# Altium schematic sheet [09] - PCB AND MECHANICALS.SchDoc
size A2; Organization: Altium Limited; Address1: L3, 12a Rodborough Rd; Address2: Frenchs Forest; Address3: NSW; Address4: Australia 2086; DocumentNumber: 9; SheetNumber: 9; SheetTotal: 11
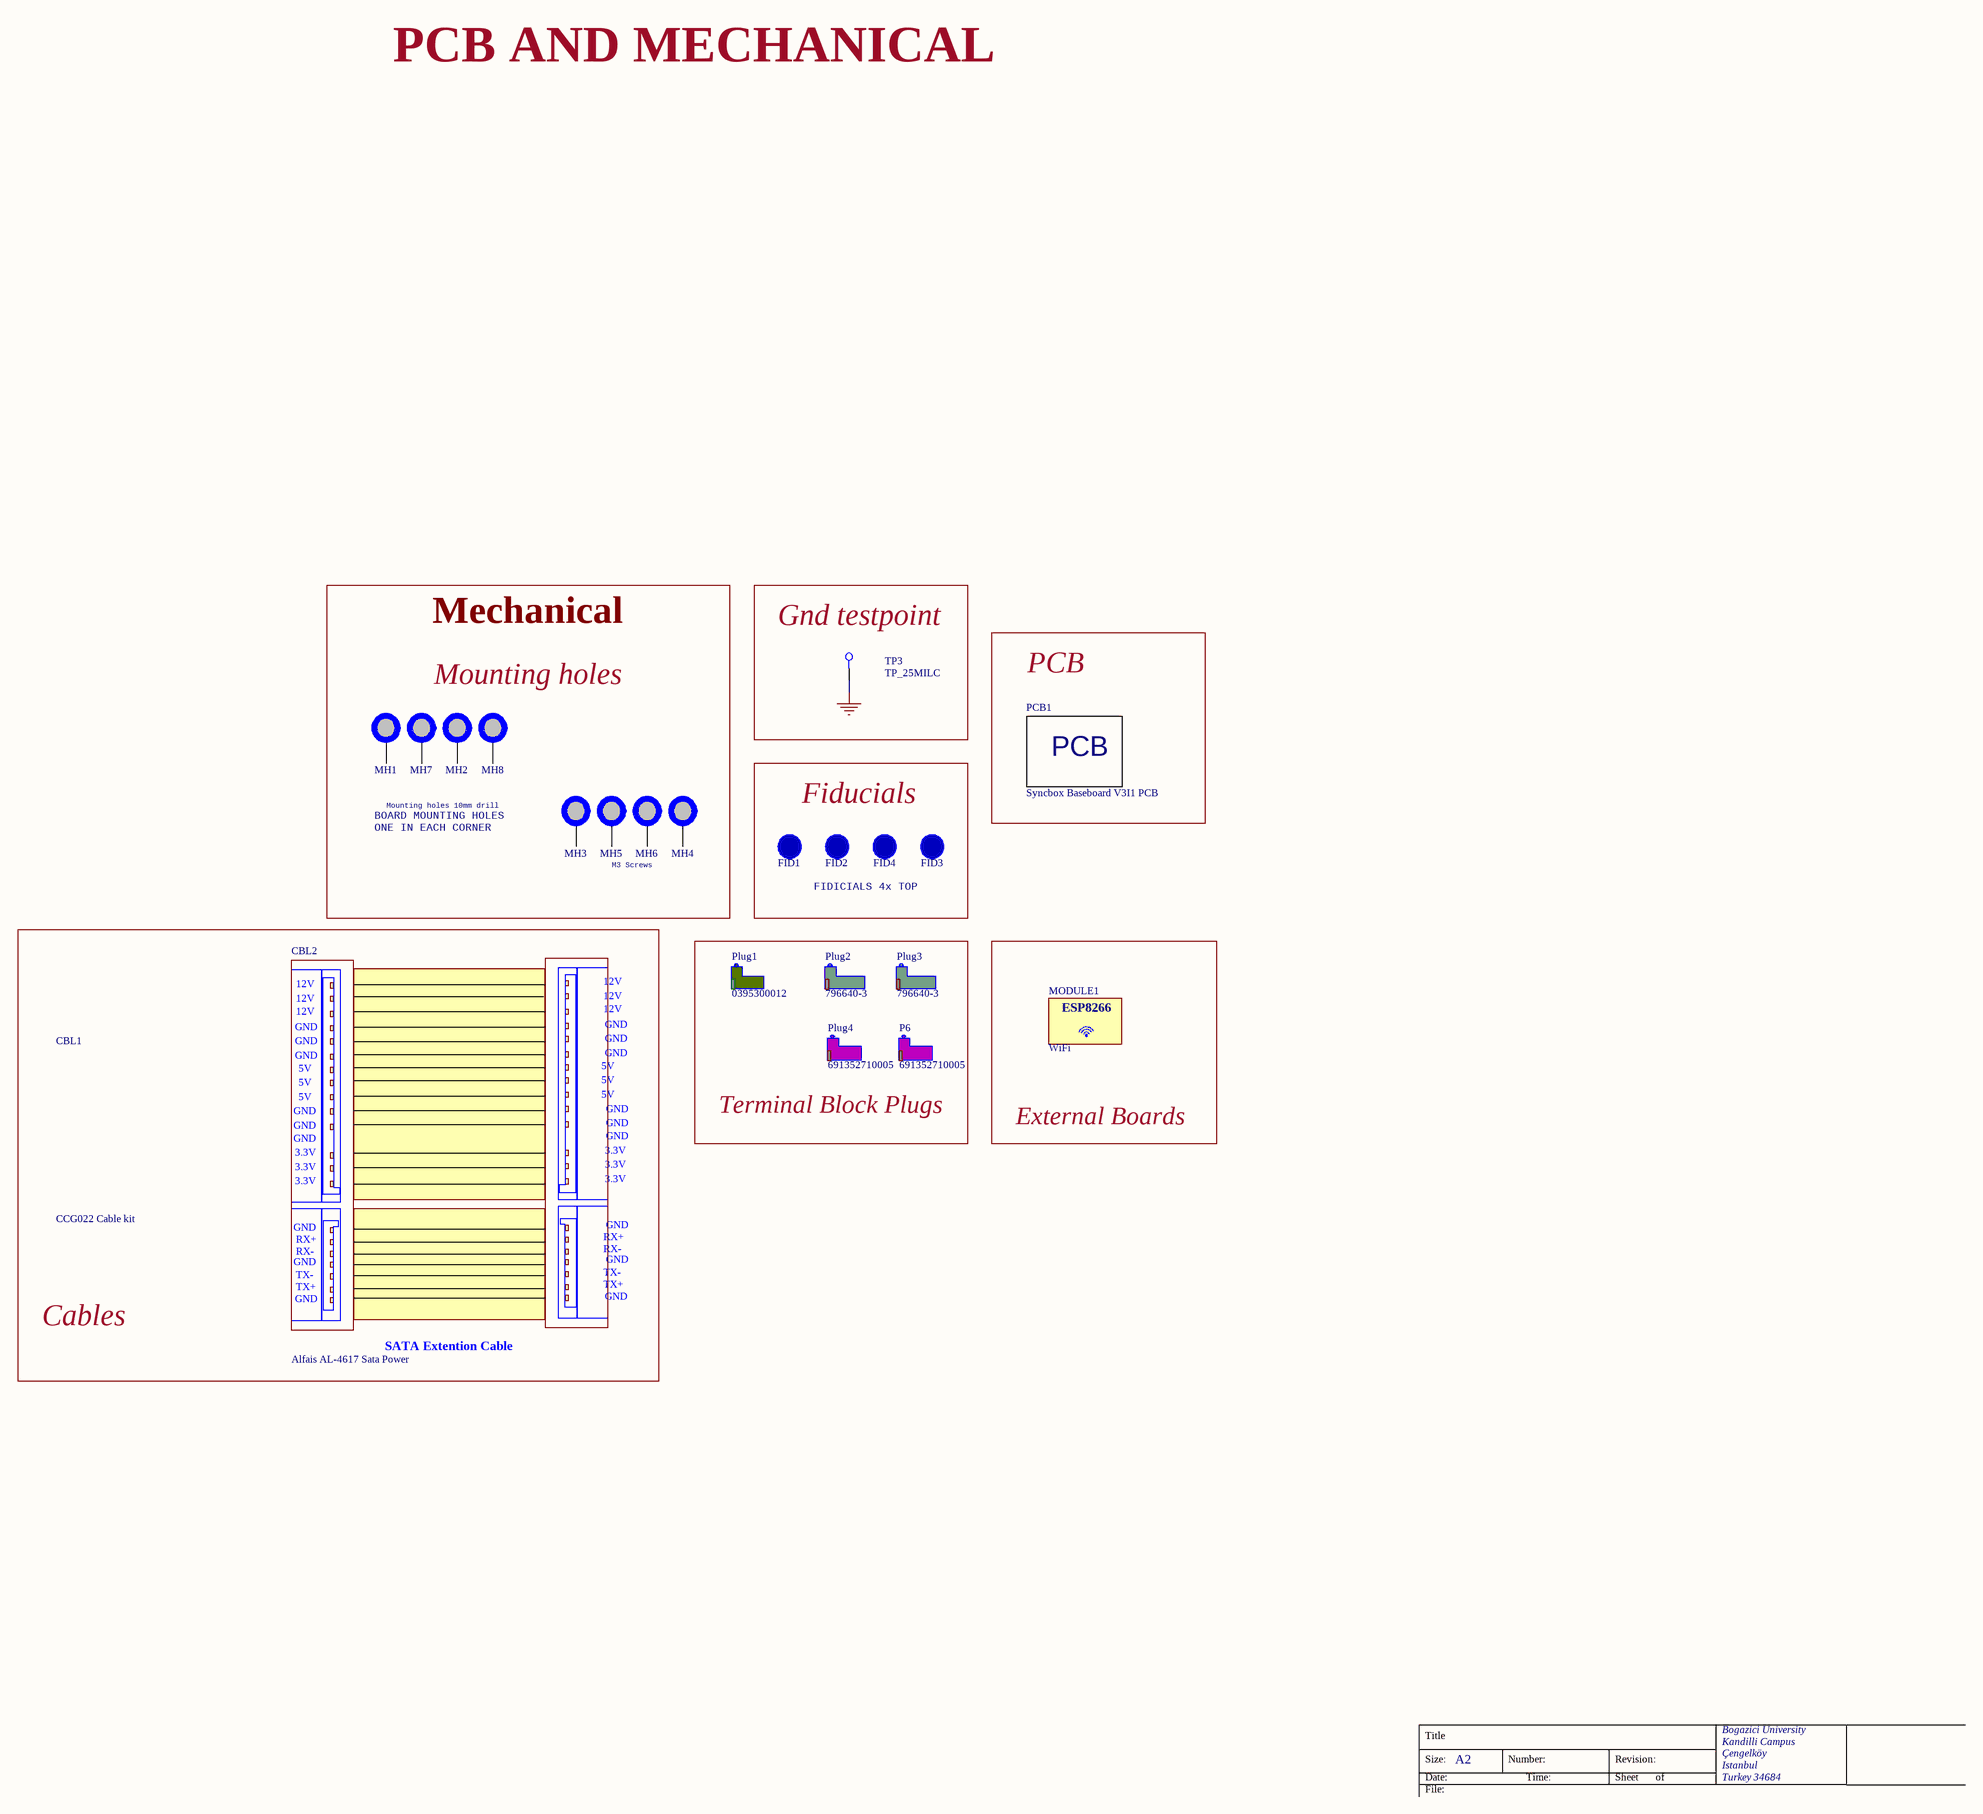
[diagram p0: [09] - PCB AND MECHANICALS.SchDoc]

## Parts
CBL1  CCG022 Cable kit
CBL2  Alfais AL-4617 Sata Power
FID1  FID_1MMC  [FID_40X120D]  (value not drawn)  (no BOM)
FID2  FID_1MMC  [FID_40X120D]  (value not drawn)  (no BOM)
FID3  FID_1MMC  [FID_40X120D]  (value not drawn)  (no BOM)
FID4  FID_1MMC  [FID_40X120D]  (value not drawn)  (no BOM)
MH1  MH_12MMC_10MMD  [MH_12MMC_10MMD]  (value not drawn)  (no BOM)
MH2  MH_12MMC_10MMD  [MH_12MMC_10MMD]  (value not drawn)  (no BOM)
MH3  MH_7MMC_3.2MMD  [MH_7MMC_3.2MMD]  (value not drawn)  (no BOM)
MH4  MH_7MMC_3.2MMD  [MH_7MMC_3.2MMD]  (value not drawn)  (no BOM)
MH5  MH_7MMC_3.2MMD  [MH_7MMC_3.2MMD]  (value not drawn)  (no BOM)
MH6  MH_7MMC_3.2MMD  [MH_7MMC_3.2MMD]  (value not drawn)  (no BOM)
MH7  MH_12MMC_10MMD  [MH_12MMC_10MMD]  (value not drawn)  (no BOM)
MH8  MH_12MMC_10MMD  [MH_12MMC_10MMD]  (value not drawn)  (no BOM)
MODULE1  WiFi
P6  691352710005
PCB1  Syncbox Baseboard V3I1 PCB  (mechanical)
Plug1  0395300012
Plug2  796640-3
Plug3  796640-3
Plug4  691352710005
TP3  TP_25MILC  [TP_25C]  (no BOM)

## Blocks framed on the sheet
Mechanical: MH1-MH8
Gnd testpoint: TP3
PCB: PCB1
Fiducials: FID1-FID4
Cables: CBL1 CBL2
Terminal Block Plugs: P6 Plug1-Plug4
External Boards: MODULE1

## Nets
GND: TP3.1

Not connected (* = marked no-connect by the designer): MH1 1; MH2 1; MH3 1; MH4 1; MH5 1; MH6 1; MH7 1; MH8 1

## Notes on the sheet
- PCB AND MECHANICAL
- Mounting holes
- BOARD MOUNTING HOLES
- Mounting holes 10mm drill
- ONE IN EACH CORNER
- M3 Screws
- FIDICIALS 4x TOP
- Title
- Bogazici University
- Size:
- Date:
- File:
- A2
- Number:
- Time:
- Revision:
- Sheet
- of
- Kandilli Campus
- Çengelköy
- Istanbul
- Turkey 34684
- (in symbol PCB_iMX6_REX_Baseboard_V1I1) PCB
- (in symbol Sata Cable) 12V; GND; 5V; 3.3V; RX+; RX-; TX-; TX+; SATA Extention Cable

## Library data of the parts
CBL1 = CCG022 Cable kit: Manufacturer 1: Connect Tech Inc.; Description 1: CCG022 Cable kit
CBL2 = Sata Cable: Link: https://www.hepsiburada.com/alfais-al-4617-sata-power-uzatma-kablosu-15-7-pin-erkek-disi-p-HBV0000036H5X?magaza=Evaletim&wt_gl=cpc.elk.bilgisayar-diger.pla&gclid=CjwKCAjwqarbBRBtEiwArlfEIASQuXBo12kuMcANrOEiBIck8mIu7ZL_Q8g_5a_TDIHKOnPRLHuDrhoCfg0QAvD_BwE; Manufacturer 1: Alfais; Description 1: Alfais AL-4617 Sata Power
FID1-FID4 = FID_1MMC: Fiducial 40mil Diameter, 120mil Mask; .Checked PCB: CHK; Supplier: Digikey; .Checked SCH: CHK
MH1 MH2 MH7 MH8 = MH_12MMC_10MMD: Mounting Hole 12mm Diameter, 10mm Drill
MH3-MH6 = MH_7MMC_3.2MMD: Mounting Hole 7mm Diameter, 3.2mm Drill
MODULE1 = ESP8266 WiFi Module: TXRX ESP8266 MOD WIFI TRACE ANT; Manufacturer 1: Seeed Technology Co., Ltd; Manufacturer Part Number 1: 317060016; Protocol: 802.11b/g/n; Frequency: 2.4GHz ~ 2.48GHz; Data Rate: 72.2Mbps; Power - Output: 15dBm; Sensitivity: -98dBm; Serial Interfaces: UART; Antenna Type: Integrated, Trace; Memory Size: 1MB Flash; Voltage - Supply: 3.3V; Current - Receiving: 62mA; Current - Transmitting: 215mA; RoHS: RoHS Compliant; Stock 1: 326; Pricing 1: 1=7.09 (USD); Packaging: Bulk; Part Status: Active; RF Family/Standard: WiFi; Modulation: -; Utilized IC / Part: ESP8266; Mounting Type: Through Hole; Operating Temperature: -20°C ~ 100°C; Package / Case: Module; ComponentLink1URL: https://media.digikey.com/pdf/Data%20Sheets/Seeed%20Technology/317060016_Web.pdf; ComponentLink1Description: https://media.digikey.com/pdf/Data%20Sheets/Seeed%20Technology/317060016_Web.pdf; Supplier 1: Digi-Key; Supplier Part Number 1: 1597-1145-ND; Description 1: TXRX ESP8266 MOD WIFI TRACE ANT; Category: RF/IF and RFID
P6 Plug4 = 691352710005: TERM BLOCK PLUG 5POS STR 5MM; Manufacturer 1: Wurth Electronics Inc.; Number of Positions: 5; Number of Levels: 1; Pitch: 0.197" (5.00mm); Plug Wire Entry: 180°; Wire Gauge or Range - AWG: 12-24 AWG; Wire Gauge or Range - mm²: 0.2-3mm²; Material Flammability Rating: UL94 V-0; Screw Size: M3; Torque - Screw: 0.56 Nm (5.0 Lb-In); Wire Strip Length: 7-8mm; Manufacturer Part Number 1: 691352710005; RoHS: RoHS Compliant; Stock 1: 164; Pricing 1: 1=3.02, 10=2.706, 50=2.337, 150=2.091, 300=1.968 (USD); Packaging: Bulk; Part Status: Active; Type: Plug, Female Sockets; Positions Per Level: 5; Header Orientation: -; Termination Style: Screw - Leaf Spring, Wire Guard; Mounting Type: Free Hanging (In-Line); Current - IEC: -; Color: Green; Operating Temperature: -40°C ~ 105°C; Contact Mating Finish: -; Features: Retention Latches (Non-Wire Side); Ingress Protection: -; Contact Material: -; Housing Material: Polyamide (PA66), Nylon 6/6; Contact Tail Length: -; Insulation Height: 0.594" (15.09mm); ComponentLink1URL: http://katalog.we-online.de/em/datasheet/6913527100xx.pdf; ComponentLink1Description: http://katalog.we-online.de/em/datasheet/6913527100xx.pdf; Supplier 1: Digi-Key; Supplier Part Number 1: 732-2778-ND; Description 1: TERM BLOCK PLUG 5POS STR 5MM; Category: Connectors, Interconnects
PCB1 = PCB_iMX6_REX_Baseboard_V1I1: Printed Circuit Board; .Creator: MM; Category: Printed circuits board
Plug1 = 0395300012: TERM BLOCK PLUG 12POS STR 5.08MM; Manufacturer 1: Molex, LLC; Number of Positions: 12; Number of Levels: 1; Pitch: 0.200" (5.08mm); Plug Wire Entry: 180°; Wire Gauge or Range - AWG: 12-26 AWG; Screw Size: M3; Torque - Screw: 0.56 Nm (5.0 Lb-In); Wire Strip Length: 5mm; Manufacturer Part Number 1: 0395300012; RoHS: RoHS Compliant; Stock 1: 734; Pricing 1: 1=6.65, 10=5.245, 25=4.9892, 50=4.5286, 100=4.3494, 250=3.83772, 500=3.58188, 1000=3.32602 (USD); Packaging: Bulk; Part Status: Active; Type: Plug, Female Sockets; Positions Per Level: 12; Header Orientation: -; Termination Style: Screw - Rising Cage Clamp; Mounting Type: Free Hanging (In-Line); Current - IEC: -; Wire Gauge or Range - mm²: -; Color: Black; Operating Temperature: -40°C ~ 115°C; Contact Mating Finish: Tin; Features: Retention Latches (Non-Wire Side); Material Flammability Rating: -; Ingress Protection: -; Contact Material: Copper Alloy; Housing Material: Polyamide (PA), Nylon; Contact Tail Length: -; Insulation Height: 0.591" (15.00mm); ComponentLink1URL: https://www.molex.com/pdm_docs/sd/395300002_sd.pdf; ComponentLink1Description: https://www.molex.com/pdm_docs/sd/395300002_sd.pdf; Supplier 1: Digi-Key; Supplier Part Number 1: WM7825-ND; Description 1: TERM BLOCK PLUG 12POS STR 5.08MM; Category: Connectors, Interconnects
Plug2 Plug3 = 796640-3: TERM BLOCK PLUG 3POS STR 5MM; Manufacturer 1: TE Connectivity AMP Connectors; Number of Positions: 3; Number of Levels: 1; Pitch: 0.197" (5.00mm); Plug Wire Entry: 180°; Wire Gauge or Range - AWG: 12-30 AWG; Wire Gauge or Range - mm²: 0.05-3mm²; Material Flammability Rating: UL94 V-0; Screw Size: M3; Torque - Screw: 0.79 Nm (7.0 Lb-In); Wire Strip Length: 6-7.5mm; Manufacturer Part Number 1: 796640-3; RoHS: RoHS Compliant; Stock 1: 7038; Pricing 1: 1=2.83, 10=2.144, 25=1.9872, 50=1.7866, 100=1.7431, 250=1.5252, 500=1.39446, 1000=1.26373, 5000=1.11121 (USD); Packaging: Bulk; Part Status: Active; Type: Plug, Female Sockets; Positions Per Level: 3; Header Orientation: -; Termination Style: Screw - Rising Cage Clamp; Mounting Type: Free Hanging (In-Line); Current - IEC: -; Color: Green; Operating Temperature: -40°C ~ 110°C; Contact Mating Finish: Tin; Features: Retention Latches (Non-Wire Side), Side Stacking; Ingress Protection: -; Contact Material: Phosphor Bronze; Housing Material: Polyamide (PA66), Nylon 6/6; Contact Tail Length: -; Insulation Height: 0.610" (15.49mm); ComponentLink1URL: http://www.te.com/commerce/DocumentDelivery/DDEController?Action=srchrtrv&DocNm=796640&DocType=Customer+Drawing&DocLang=English; ComponentLink1Description: http://www.te.com/commerce/DocumentDelivery/DDEController?Action=srchrtrv&DocNm=796640&DocType=Customer+Drawing&DocLang=English; Supplier 1: Digi-Key; Supplier Part Number 1: A98242-ND; Description 1: TERM BLOCK PLUG 3POS STR 5MM; Category: Connectors, Interconnects
TP3 = TP_25MILC: Test Point 25mil; .Checked PCB: CHK; .Checked SCH: CHK